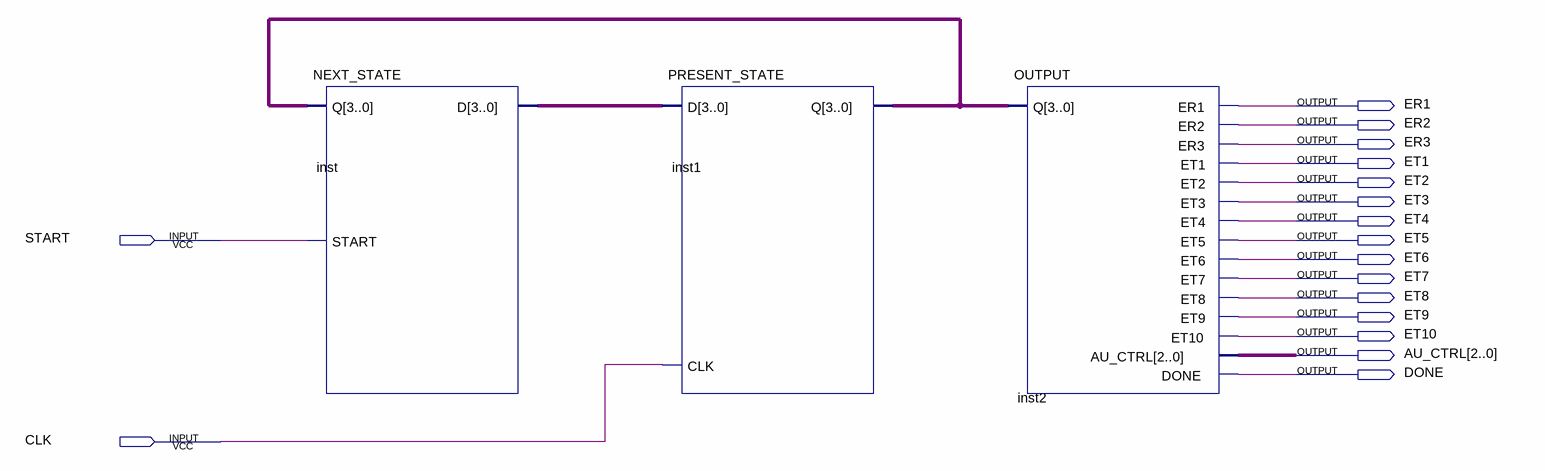
[diagram p0: schematic sheet]
// Quartus schematic Pipelined_Function_CONTROLLER.bdf as structural Verilog: 3 symbols, 17 pins
module Pipelined_Function_CONTROLLER (
  input  START,
  input  CLK,
  output ER1,
  output ER2,
  output ER3,
  output ET1,
  output ET2,
  output ET3,
  output ET4,
  output ET5,
  output ET6,
  output ET7,
  output ET8,
  output ET9,
  output ET10,
  output [2:0] AU_CTRL,
  output DONE
);

  wire [3:0] inst1_q, inst_d;

  NEXT_STATE inst (.START(START), .Q(inst1_q), .D(inst_d));
  PRESENT_STATE inst1 (.CLK(CLK), .D(inst_d), .Q(inst1_q));
  OUTPUT inst2 (
    .Q(inst1_q), .ER1(ER1), .ER2(ER2), .ER3(ER3), .ET1(ET1), .ET2(ET2), .ET3(ET3), .ET4(ET4), .ET5(ET5),
    .ET6(ET6), .ET7(ET7), .ET8(ET8), .ET9(ET9), .ET10(ET10), .AU_CTRL(AU_CTRL), .DONE(DONE));
endmodule
